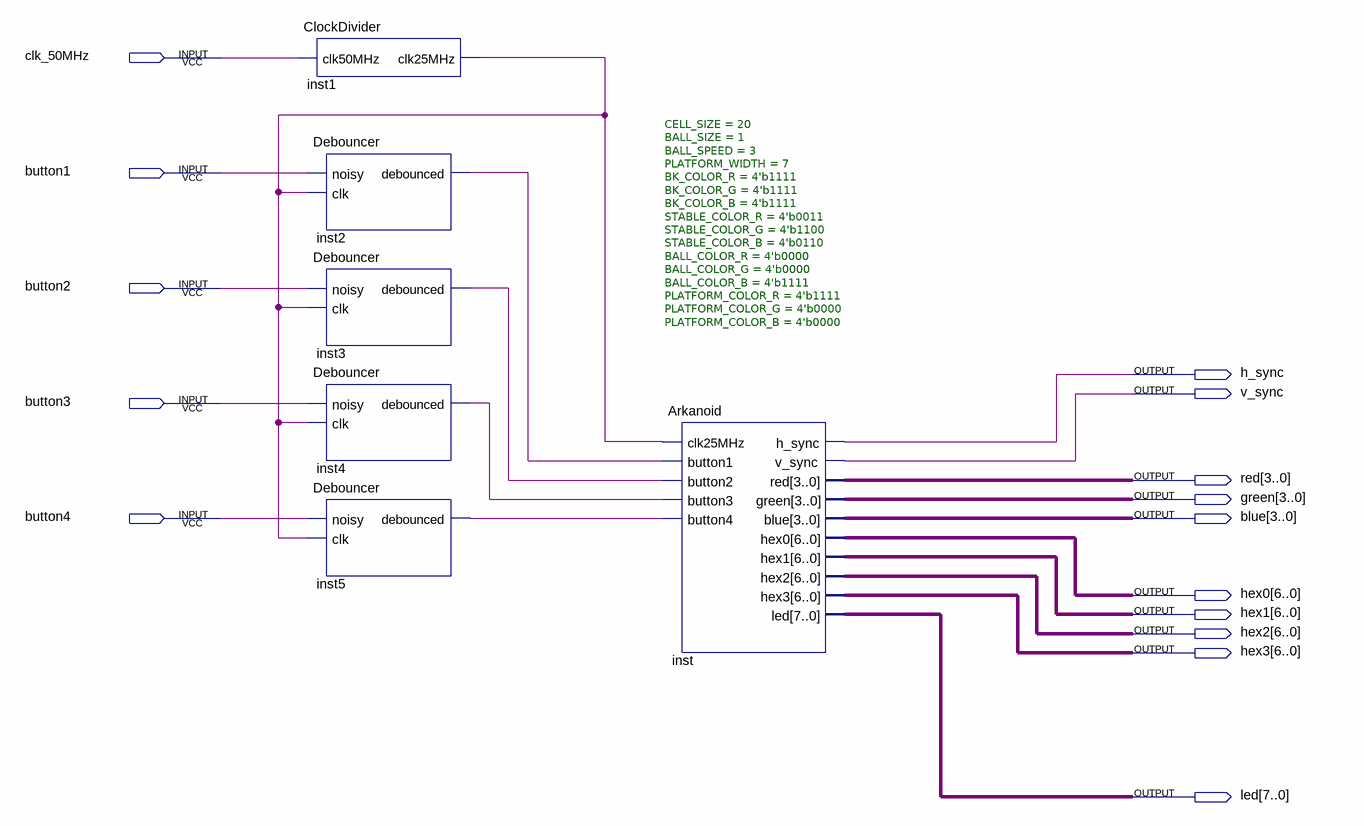
[diagram p0: schematic sheet]
// Quartus schematic TotalScheme.bdf as structural Verilog: 6 symbols, 15 pins
module TotalScheme (
  input  clk_50MHz,
  input  button1,
  input  button2,
  input  button3,
  input  button4,
  output h_sync,
  output v_sync,
  output [3:0] red,
  output [3:0] green,
  output [3:0] blue,
  output [6:0] hex0,
  output [6:0] hex1,
  output [6:0] hex2,
  output [6:0] hex3,
  output [7:0] led
);

  wire inst1_clk25mhz, inst2_debounced, inst3_debounced, inst4_debounced, inst5_debounced;

  ClockDivider inst1 (.clk50MHz(clk_50MHz), .clk25MHz(inst1_clk25mhz));
  Debouncer inst2 (.noisy(button1), .clk(inst1_clk25mhz), .debounced(inst2_debounced));
  Debouncer inst3 (.noisy(button2), .clk(inst1_clk25mhz), .debounced(inst3_debounced));
  Debouncer inst4 (.noisy(button3), .clk(inst1_clk25mhz), .debounced(inst4_debounced));
  Debouncer inst5 (.noisy(button4), .clk(inst1_clk25mhz), .debounced(inst5_debounced));
  Arkanoid #(.CELL_SIZE(20), .BALL_SIZE(1), .BALL_SPEED(3), .PLATFORM_WIDTH(7), .BK_COLOR_R(4'b1111), .BK_COLOR_G(4'b1111), .BK_COLOR_B(4'b1111), .STABLE_COLOR_R(4'b0011), .STABLE_COLOR_G(4'b1100), .STABLE_COLOR_B(4'b0110), .BALL_COLOR_R(4'b0000), .BALL_COLOR_G(4'b0000), .BALL_COLOR_B(4'b1111), .PLATFORM_COLOR_R(4'b1111), .PLATFORM_COLOR_G(4'b0000), .PLATFORM_COLOR_B(4'b0000)) inst (
    .clk25MHz(inst1_clk25mhz), .button1(inst2_debounced), .button2(inst3_debounced),
    .button3(inst4_debounced), .button4(inst5_debounced), .h_sync(h_sync), .v_sync(v_sync), .red(red),
    .green(green), .blue(blue), .hex0(hex0), .hex1(hex1), .hex2(hex2), .hex3(hex3), .led(led));
endmodule
